# Altium schematic sheet Connectors_and_Protection.SchDoc
size A
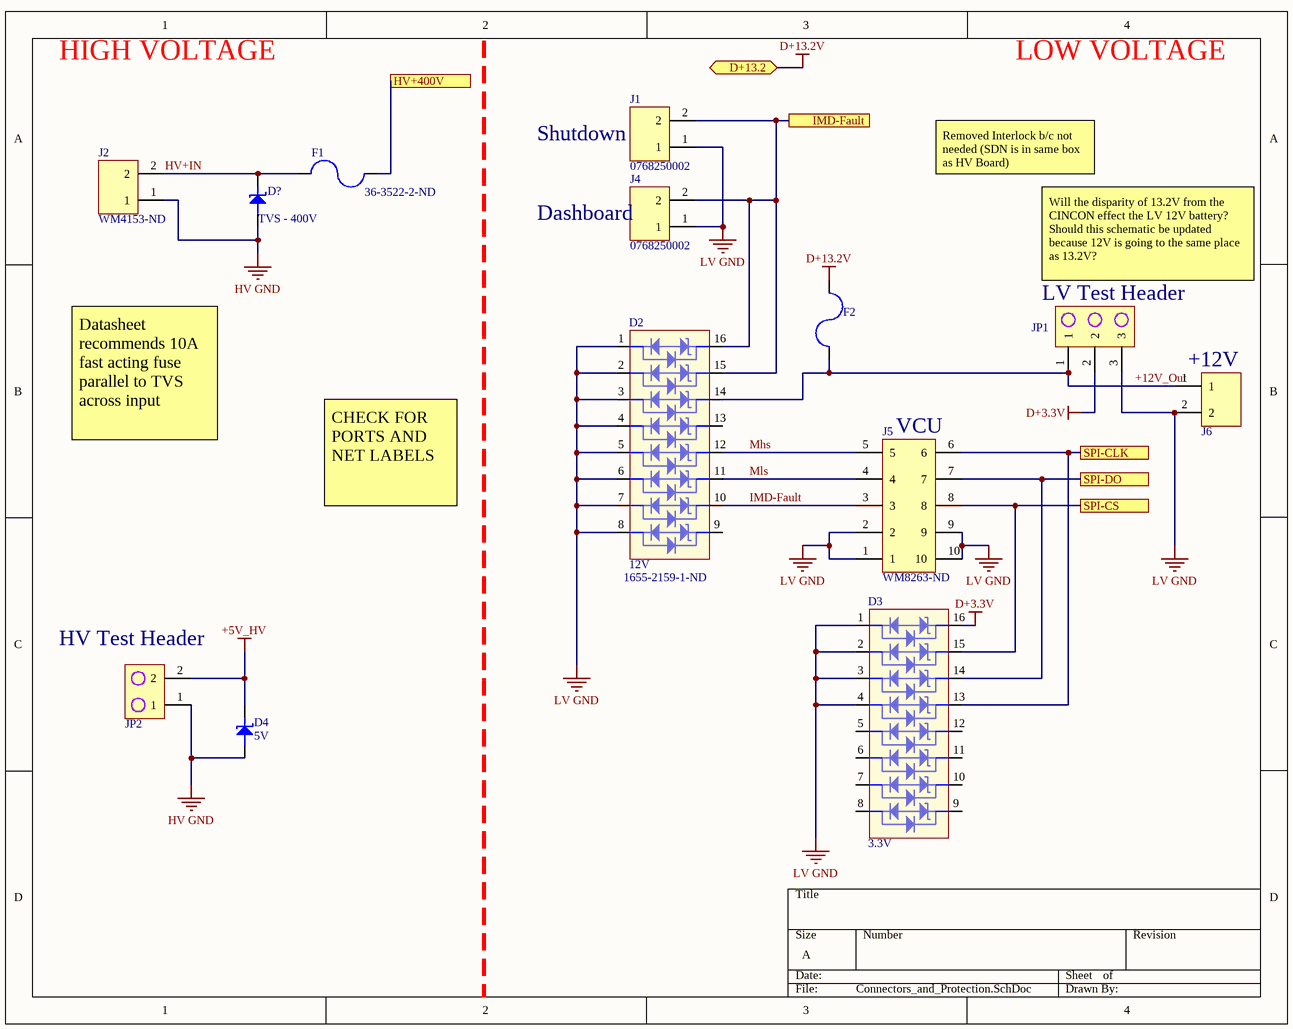
[diagram p0: Connectors_and_Protection.SchDoc]

## Parts
D2  12V  Supplier Part Number 1: 1655-2159-1-ND  [16-SO]
D3  3.3V  [16-SO]
D4  5V  [DIODE-SOD323]
D?  TVS - 400V  [DO-214AA, SMB]
F1  36-3522-2-ND  [Fuse Holder - 500V - 20A]
F2  36-3555-2-ND  [Fuse Holder - 500V - 50A]  (value not drawn)
J1  0768250002  [2X1PIN]
J2  WM4153-ND  [2PIN]
J4  0768250002  [2X1PIN]
J5  WM8263-ND  [2X5PIN]
J6  952-2900-ND  [2Pin-POWER]  (value not drawn)
JP1  732-5316-ND  [3PIN-JP]  (value not drawn)
JP2  732-5315-ND  [2PIN-JP]  (value not drawn)

## Ports
D+13.2 (bidir), HV+400V, IMD-Fault, SPI-CLK, SPI-CS, SPI-DO

## Nets
+5V_HV: D4.1 JP2.2
D+3.3V: D3.16 JP1.2
D+13.2V: F2.2 ; port D+13.2
HV GND: D4.2 D?.2 J2.1 JP2.1
LV GND: D2.1 D2.2 D2.3 D2.4 D2.5 D2.6 D2.7 D2.8 D3.1 D3.2 D3.3 D3.4 J1.1 J4.1 J5.1 J5.2 J5.9 J5.10 J6.2 JP1.3
+12V_Out: D2.14 F2.1 J6.1 JP1.1
HV+400V: F1.2 ; port HV+400V
HV+IN: D?.1 F1.1 J2.2
IMD-Fault: D2.10 J5.3
IMD-Fault: D2.15 D2.16 J1.2 J4.2 ; port IMD-Fault  [a separate net that carries the same name]
Mhs: D2.12 J5.5
Mls: D2.11 J5.4
SPI-CLK: D3.13 J5.6 ; port SPI-CLK
SPI-CS: D3.15 J5.8 ; port SPI-CS
SPI-DO: D3.14 J5.7 ; port SPI-DO

Not connected (* = marked no-connect by the designer): D2 9 13; D3 5 6 7 8 9 10 11 12

## Notes on the sheet
- HIGH VOLTAGE
- LOW VOLTAGE
- Shutdown
- Removed Interlock b/c not needed (SDN is in same box as HV Board)
- (near J4) Dashboard
- (near JP1) LV Test Header
- Will the disparity of 13.2V from the CINCON effect the LV 12V battery? Should this schematic be updated because 12V is going to the same place as 13.2V?
- (near J6) +12V
- Datasheet recommends 10A fast acting fuse parallel to TVS across input
- (near J5) VCU
- CHECK FOR PORTS AND NET LABELS
- (near JP2) HV Test Header

## Library data of the parts
D2 = TVS-12V-X8: PD 300W VWM 12VCJ 25PFPACKAGE SO; Supplier 1: Digi-Key
D3 = TVS-3.3V-X8: PD 300W VWM 3.3VCJ 25PFPACKAGE S; Supplier 1: Digi-Key; Supplier Part Number 1: 1655-2157-1-ND
D4 = TVS-5V: TVS DIODE 5V SOD323; Manufacturer: Nexperia; Manufacturer Part Number: PESD5V0U1UA,115; Supplier 1: Digi-Key; Stock 1: 127058; Pricing 1: 1=0.43, 10=0.32, 25=0.28, 100=0.152, 250=0.1512, 500=0.124, 1000=0.092 (USD); ComponentLink1URL: https://assets.nexperia.com/documents/data-sheet/PESD5V0U1UA_UB_UL.pdf?src-supplier=Digi-Key; ComponentLink1Description: https://assets.nexperia.com/documents/data-sheet/PESD5V0U1UA_UB_UL.pdf?src-supplier=Digi-Key; ComponentLink2URL: http://www.farnell.com/datasheets/453996.pdf?src-supplier=Farnell; ComponentLink2Description: http://www.farnell.com/datasheets/453996.pdf?src-supplier=Farnell; Supplier Part Number 1: 1727-4155-6-ND
D? = SMBJE400CA: Manufacturer: Eaton Bussmann; Supplier 1: Digi-Key; Manufacturer Part Number: SMBJE400CA; RoHS: No; Stock 1: 2965; Pricing 1: 1=0.44000, 10=0.37500, 100=0.28030, 500=0.22022, 1000=0.17017 (USD); Supplier Part Number 1: 283-SMBJE400CACT-ND
F1 = Fuse Holder - 500V - 20A: FUSE CLIP BLADE 500V 20A PCB; Supplier 1: Digi-Key
F2 = Fuse Holder - 500V - 50A: FUSE BLOCK BLADE 500V 50A PCB; Supplier 1: Digi-Key
J1 J4 = 2X1PIN: CONN HEADER R/A 2POS; Manufacturer: Molex; Manufacturer Part Number: 76825-0002; Number of Circuits: 2; Gender: Male; Pitch: 5.7mm; Supplier 1: Digi-Key; Stock 1: 0; Pricing 1: 1=1.13, 10=0.993, 25=0.9344, 50=0.8956, 100=0.8567, 250=0.7788, 500=0.70092, 1000=0.62304, 2500=0.56463 (USD); Color: Black; Contact Plating: Tin; Contact Material: Copper; Termination: Through Hole; Number of Rows: 2; Orientation: Right Angle; Number of Contacts: 2; REACH SVHC: Unknown; ComponentLink1URL: http://www.farnell.com/datasheets/1968956.pdf?src-supplier=Element14; ComponentLink1Description: http://www.farnell.com/datasheets/1968956.pdf?src-supplier=Element14; ComponentLink2URL: http://www.farnell.com/datasheets/2216551.pdf?src-supplier=Newark; ComponentLink2Description: http://www.farnell.com/datasheets/2216551.pdf?src-supplier=Newark; ComponentLink3URL: http://www.farnell.com/datasheets/2216551.pdf?src-supplier=Farnell; ComponentLink3Description: http://www.farnell.com/datasheets/2216551.pdf?src-supplier=Farnell; ComponentLink4URL: https://www.molex.com/pdm_docs/sd/768250002_sd.pdf?src-supplier=Digi-Key; ComponentLink4Description: https://www.molex.com/pdm_docs/sd/768250002_sd.pdf?src-supplier=Digi-Key; ComponentLink5URL: http://www.farnell.com/datasheets/2001779.pdf?src-supplier=Element14; ComponentLink5Description: http://www.farnell.com/datasheets/2001779.pdf?src-supplier=Element14; ComponentLink6URL: http://www.alliedelec.com/images/products/datasheets/bm/BrandonData/70717238.pdf?src-supplier=Allied+Electronics; ComponentLink6Description: http://www.alliedelec.com/images/products/datasheets/bm/BrandonData/70717238.pdf?src-supplier=Allied+Electronics; Supplier Part Number 1: WM11969-ND
J2 = 2PIN: CONN HEADER R/A 2POS 2.54MM; Manufacturer: Molex; Manufacturer Part Number: 0705530106; Number of Positions: 2; Contact Resistance: 30mR; Connector Type: Male Pin; Supplier 1: Digi-Key; Stock 1: 2224; Pricing 1: 1=1.38, 10=1.25, 100=1.071, 500=0.8925, 1000=0.765, 5000=0.6783, 10000=0.663 (USD); Mount: Through Hole; Housing Material: Polyester; Contact Plating: Gold; Contact Material: Bronze; Color: Black; Housing Color: Black; Min Operating Temperature: -40°C; Max Operating Temperature: 105°C; Number of Rows: 1; Packaging: Rail/Tube; Termination: Solder; Number of Contacts: 2; Orientation: Right Angle; Length: 7.37mm; Pitch: 2.54mm; Depth: 13.59mm; Contact Mating Length: 0.24inch; ComponentLink1URL: http://www.molex.com/webdocs/datasheets/pdf/en-us/0705530106_PCB_HEADERS.pdf?src-supplier=Avnet+Asia; ComponentLink1Description: http://www.molex.com/webdocs/datasheets/pdf/en-us/0705530106_PCB_HEADERS.pdf?src-supplier=Avnet+Asia; ComponentLink2URL: https://www.molex.com/pdm_docs/ps/PS-70400.pdf?src-supplier=Digi-Key; ComponentLink2Description: https://www.molex.com/pdm_docs/ps/PS-70400.pdf?src-supplier=Digi-Key; Supplier Part Number 1: WM4153-ND
J5 = 2X5PIN: CONN HEADER R/A 10POS 2.54MM; Manufacturer: Molex; Manufacturer Part Number: 90130-3110; Number of Positions: 10; Connector Type: Male Pin; Max Voltage Rating (DC): 350.35kV; Max Voltage Rating (AC): 350V; Gender: Male; Current Rating: 3A; Row Spacing: 0.1inch; Glow Wire Compliant: Non-compliant; Supplier 1: Digi-Key; Stock 1: 3596; Pricing 1: 1=1.47, 10=1.329, 100=1.1395, 500=0.94956, 1000=0.8139, 5000=0.72166, 10000=0.70538 (USD); Mount: Through Hole; Color: Black; Housing Color: Black; Housing Material: Polyester; Contact Material: Brass; Contact Plating: Tin,Lead; Min Operating Temperature: -55°C; Max Operating Temperature: 125°C; Number of Rows: 2; Packaging: Tray; Termination: Solder; Orientation: Right Angle; Number of Contacts: 10; Package Quantity: 1; Voltage Rating: 350V; Number of Circuits: 10; Voltage Rating (DC): 350V; Length: 15.42mm; Pitch: 2.54mm; Depth: 9.75mm; Contact Mating Length: 0.266inch; Radiation Hardening: No; Flammability Rating: UL94 V-0; REACH SVHC: No SVHC; Lead Free: Lead Free; ComponentLink1URL: http://www.mouser.com/ds/2/276/0901303110_PCB_HEADERS-151522.pdf?src-supplier=Mouser; ComponentLink1Description: http://www.mouser.com/ds/2/276/0901303110_PCB_HEADERS-151522.pdf?src-supplier=Mouser; ComponentLink2URL: http://uk.rs-online.com/webdocs/13c4/0900766b813c4c8e.pdf?src-supplier=RSComponents; ComponentLink2Description: http://uk.rs-online.com/webdocs/13c4/0900766b813c4c8e.pdf?src-supplier=RSComponents; ComponentLink3URL: http://www.molex.com/webdocs/datasheets/pdf/en-us/0901303110_PCB_HEADERS.pdf?src-supplier=Avnet; ComponentLink3Description: http://www.molex.com/webdocs/datasheets/pdf/en-us/0901303110_PCB_HEADERS.pdf?src-supplier=Avnet; ComponentLink4URL: http://www.molex.com/pdm_docs/sd/901303110_sd.pdf?src-supplier=Digi-Key; ComponentLink4Description: http://www.molex.com/pdm_docs/sd/901303110_sd.pdf?src-supplier=Digi-Key; ComponentLink5URL: http://www.molex.com/webdocs/datasheets/pdf/en-us/0901303110_PCB_HEADERS.pdf?src-supplier=Avnet+Europe; ComponentLink5Description: http://www.molex.com/webdocs/datasheets/pdf/en-us/0901303110_PCB_HEADERS.pdf?src-supplier=Avnet+Europe; Supplier Part Number 1: WM8263-ND
J6 = 2PIN-POWER: CONN HEADER VERT 2POS 4MM 800V 40A; Supplier 1: Digi-Key; Supplier Part Number 1: 952-2900-ND
JP1 = 3PIN-TEST: CONN HEADER VERT 3POS 2.54MM
JP2 = 2PIN-TEST: CONN HEADER VERT 2POS 2.54MM